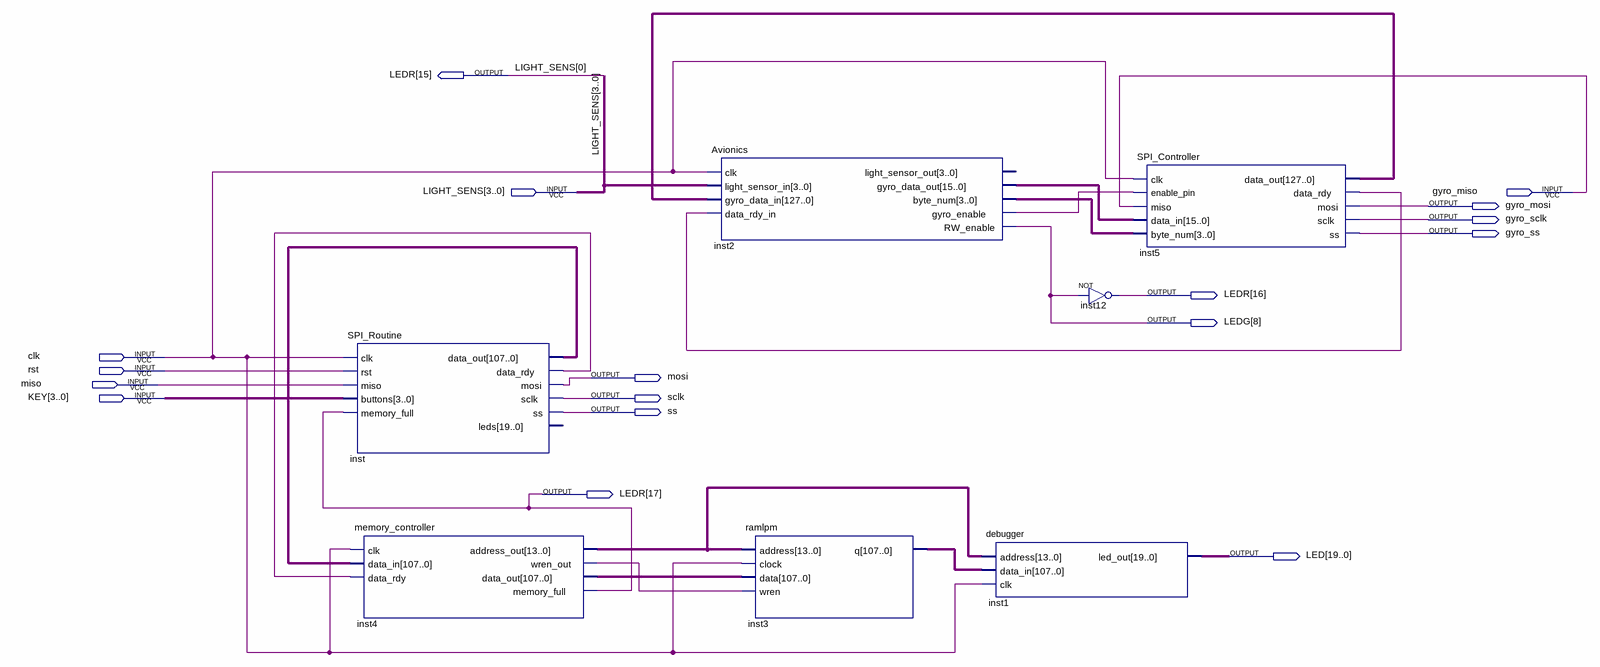
[diagram p0: schematic sheet]
// Quartus schematic Block_Design.bdf as structural Verilog: 7 symbols, 17 pins
module Block_Design (
  input  [3:0] LIGHT_SENS,
  input  gyro_miso,
  input  clk,
  input  rst,
  input  miso,
  input  [3:0] KEY,
  output [17:15] LEDR,
  output gyro_mosi,
  output gyro_sclk,
  output gyro_ss,
  output [8:8] LEDG,
  output mosi,
  output sclk,
  output ss,
  output [19:0] LED
);

  wire inst2_gyro_enable, inst4_wren_out, inst5_data_rdy, inst_data_rdy;
  wire [3:0] inst2_byte_num;
  wire [13:0] inst4_address_out;
  wire [15:0] inst2_gyro_data_out;
  wire [107:0] inst3_q, inst4_data_out, inst_data_out;
  wire [127:0] inst5_data_out;

  SPI_Routine inst (
    .clk(clk), .rst(rst), .miso(miso), .buttons(KEY), .memory_full(LEDR[17]), .data_out(inst_data_out),
    .data_rdy(inst_data_rdy), .mosi(mosi), .sclk(sclk), .ss(ss));  // open: leds
  memory_controller inst4 (
    .clk(clk), .data_in(inst_data_out), .data_rdy(inst_data_rdy), .address_out(inst4_address_out),
    .wren_out(inst4_wren_out), .data_out(inst4_data_out), .memory_full(LEDR[17]));
  Avionics inst2 (
    .clk(clk), .light_sensor_in(LIGHT_SENS), .gyro_data_in(inst5_data_out), .data_rdy_in(inst5_data_rdy),
    .gyro_data_out(inst2_gyro_data_out), .byte_num(inst2_byte_num), .gyro_enable(inst2_gyro_enable),
    .RW_enable(LEDG[8]));  // open: light_sensor_out
  ramlpm inst3 (.address(inst4_address_out), .clock(clk), .data(inst4_data_out), .wren(inst4_wren_out), .q(inst3_q));
  debugger inst1 (.address(inst4_address_out), .data_in(inst3_q), .clk(clk), .led_out(LED));
  not inst12 (LEDR[16], LEDG[8]);
  SPI_Controller inst5 (
    .clk(clk), .enable_pin(inst2_gyro_enable), .miso(gyro_miso), .data_in(inst2_gyro_data_out),
    .byte_num(inst2_byte_num), .data_out(inst5_data_out), .data_rdy(inst5_data_rdy), .mosi(gyro_mosi),
    .sclk(gyro_sclk), .ss(gyro_ss));

  assign LEDR[15] = LIGHT_SENS[0];
endmodule
